# EAGLE design GarageDoorOpener (EAGLE 6.5.0)
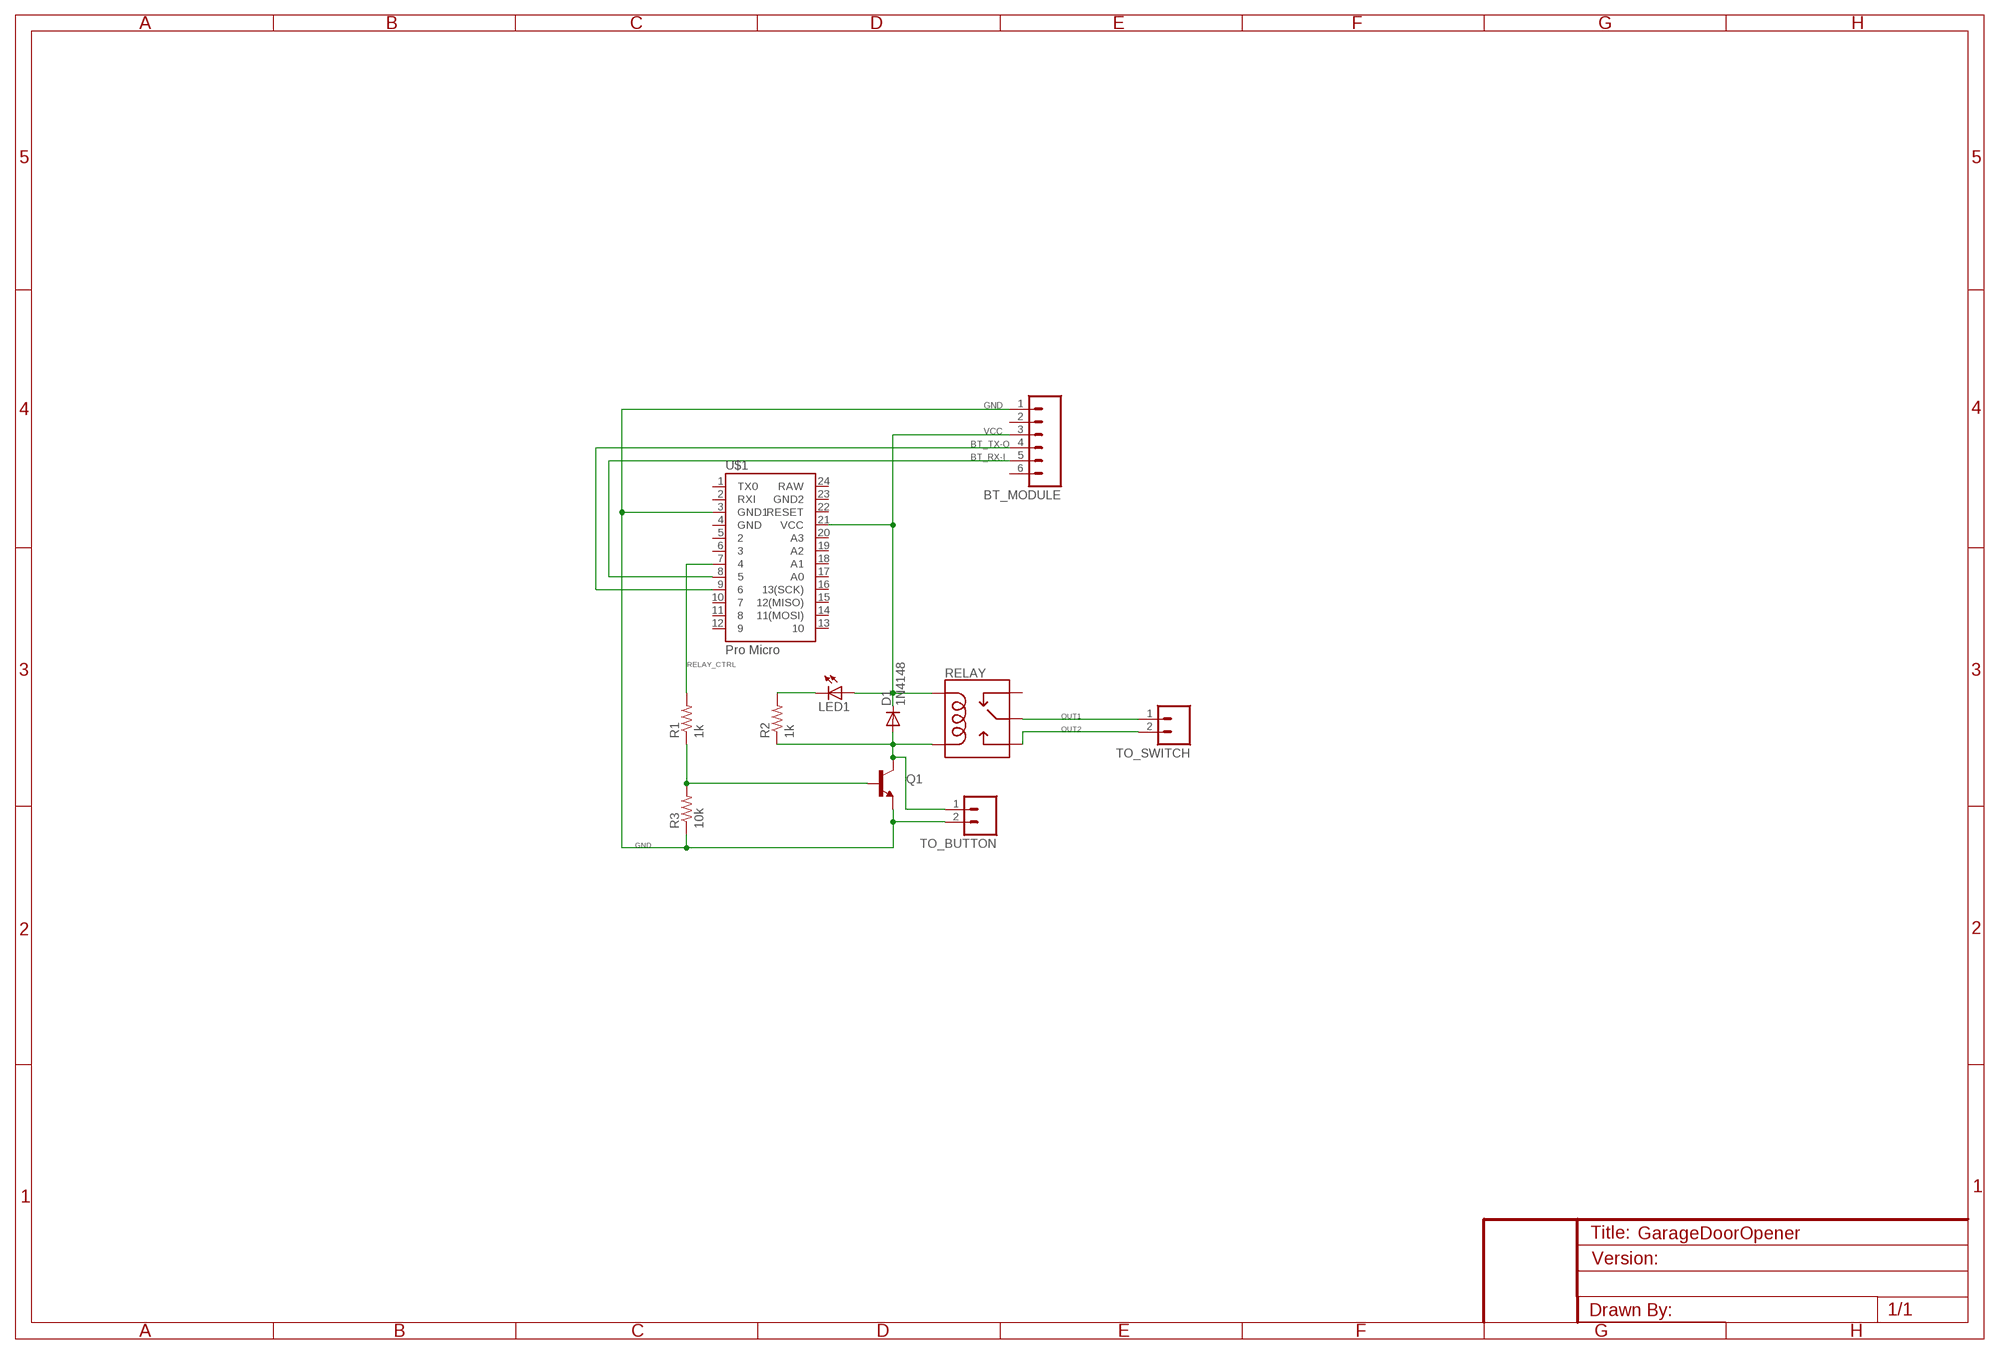
[diagram p0: schematic, sheet 1]

## Parts
BT_MODULE  M06LOCK  [1X06_LOCK]
D1  1N4148  DIODE1N4148  [DIODE-1N4148]
LED1  LED3MM  [LED3MM]
Q1  TRANSISTOR_NPNTO-92-AMMO  [TO-92-AMMO]
R1  1k  RESISTORAXIAL-0.3  [AXIAL-0.3]
R2  1k  RESISTORAXIAL-0.3  [AXIAL-0.3]
R3  10k  RESISTORAXIAL-0.3  [AXIAL-0.3]
RELAY  RELAYPTH4  [RELAY-JZC]
TO_BUTTON  M02LOCK  [1X02_LOCK]
TO_SWITCH  M02-JST-2-PTH-NO_SILK  [JST-2-PTH-NS]
U$1  Pro Micro  ARDUINO_PRO_MICRO  [ARDUINO_PRO_MICRO]

## Nets
BT_RX-I: BT_MODULE.5 U$1.8
BT_TX-O: BT_MODULE.4 U$1.9
GND: BT_MODULE.1 Q1.1(E) R3.P$1 TO_BUTTON.2 U$1.3(GND1)
N$1: D1.A Q1.3(C) R2.P$1 RELAY.1(COIL2) TO_BUTTON.1
N$2: Q1.2(B) R1.P$1 R3.P$2
N$11: LED1.K(C) R2.P$2
OUT1: RELAY.4(MAIN) TO_SWITCH.1
OUT2: RELAY.3(NO) TO_SWITCH.2
RELAY_CTRL: R1.P$2 U$1.7
VCC: BT_MODULE.3 D1.C LED1.A RELAY.5(COIL1) U$1.21(VCC)
Unconnected: BT_MODULE.2 BT_MODULE.6 RELAY.2(NC) U$1.1(TX0) U$1.2(RXI) U$1.4(GND) U$1.5 U$1.6 U$1.10 U$1.11 U$1.12 U$1.13 U$1.14(11(MOSI)) U$1.15(12(MISO)) U$1.16(13(SCK)) U$1.17(A0) U$1.18(A1) U$1.19(A2) U$1.20(A3) U$1.22(RESET) U$1.23(GND2) U$1.24(RAW)

## Library data of the parts
BT_MODULE = SparkFun-Connectors:M06: Header 6 Standard 6-pin 0.1" header. Use with straight break away headers (SKU : PRT-00116), right angle break away headers (PRT-00553), swiss pins (PRT-00743), machine pins (PRT-00117), and female headers (PRT-00115). Molex polarized connector foot print use with SKU : PRT-08094 with associated crimp pins and housings. NOTES ON THE VARIANTS LOCK and LOCK_LONGPADS... This footprint was designed to help hold the alignment of a through-hole component (i.e. 6-pin header) while soldering it into place. You may notice that each hole has been shifted either up or down by 0.005 of an inch from it's more standard position (which is a perfectly straight line). This slight alteration caused the pins (the squares in the middle) to touch the edges of the holes. Because they are alternating, it causes a "brace" to hold the component in place. 0.005 has proven to be the perfect amount of "off-center" position when using our standard breakaway headers. Although looks a little odd when you look at the bare footprint, once you have a header in there, the alteration is very hard to notice. Also,if you push a header all the way into place, it is covered up entirely on the bottom side. This idea of altering the position of holes to aid alignment will be further integrated into the Sparkfun Library for other footprints. It can help hold any component with 3 or more connection pins.
D1 = SparkFun-DiscreteSemi:DIODE: Diode These are standard reverse protection diodes and small signal diodes. SMA package can handle up to about 1A. SOD-323 can handle about 200mA. What the SOD-323 package when ordering, there are some mfgs out there that are 5-pin packages.
LED1 = SparkFun-LED:LED: LEDs Standard schematic elements and footprints for 5mm, 3mm, 1206, and 0603 sized LEDs. 5mm - Spark Fun Electronics SKU : COM-00529 (and others)
Q1 = SparkFun-DiscreteSemi:TRANSISTOR_NPN: Generic NPN BJT MMBT2222A - TRANS-08049 (SOT-23, 1A 40V) MPSA42 - TRANS-09116 (SOT-23, 500mA 300V) MMBT5088LT1G - TRANS-11160 (SOT-23, 50 mA 30V)
R1-R3 = SparkFun-Resistors:RESISTOR: Resistor Basic schematic elements and footprints for 0603, 1206, and PTH resistors.
RELAY = SparkFun-Electromechanical:RELAY: SPDT relay (COM-00101)
TO_BUTTON TO_SWITCH = SparkFun-Connectors:M02: Standard 2-pin 0.1" header. Use with - straight break away headers ( PRT-00116) - right angle break away headers (PRT-00553) - swiss pins (PRT-00743) - machine pins (PRT-00117) - female headers (PRT-00115) Molex polarized connector foot print use with: PRT-08233 with associated crimp pins and housings. 2.54_SCREWTERM for use with PRT-10571. 3.5mm Screw Terminal footprints for PRT-08084 5mm Screw Terminal footprints for use with PRT-08433
U$1 = SparkFun-Boards:ARDUINO_PRO_MICRO

## Board
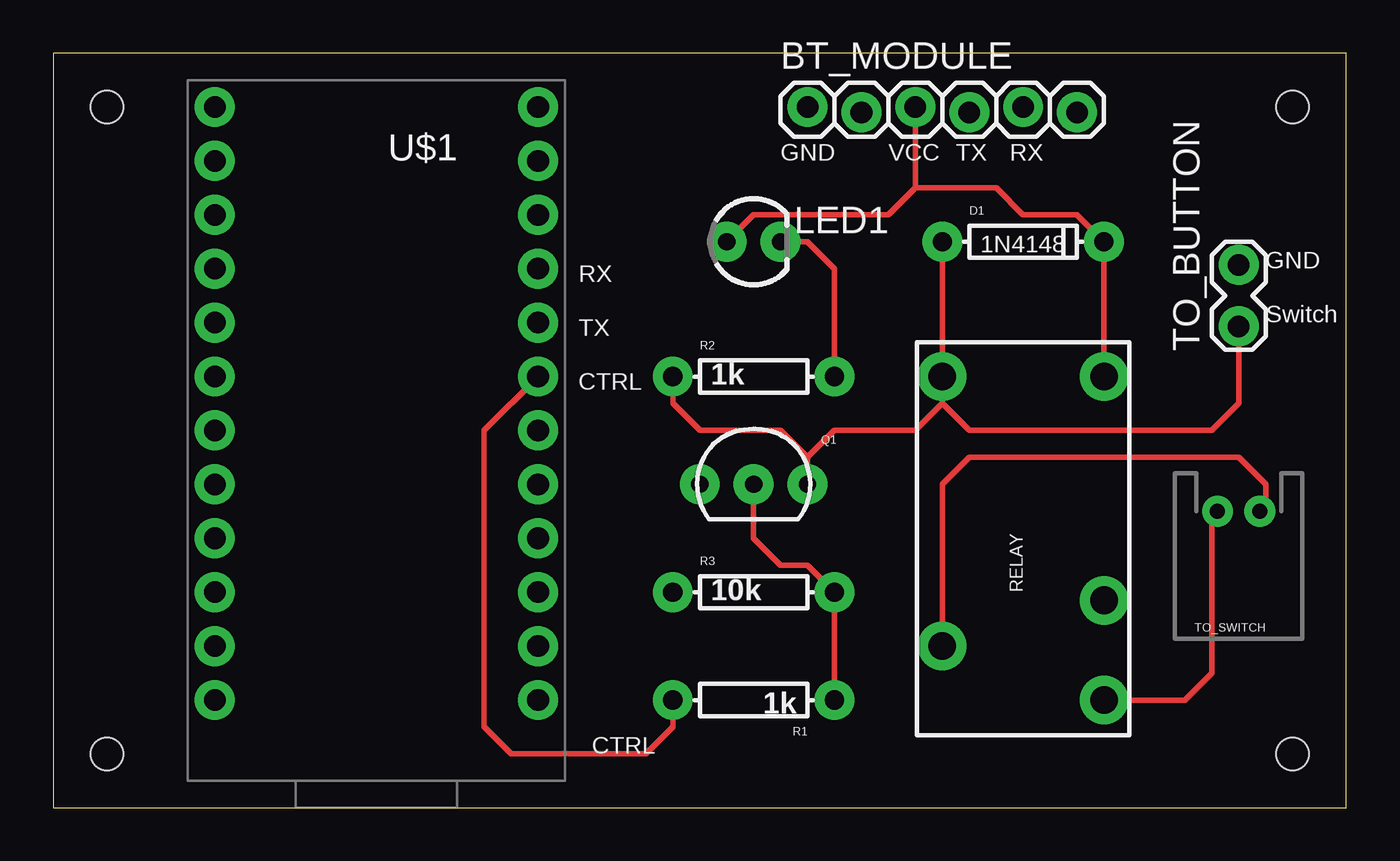
[diagram p1: board, top side]
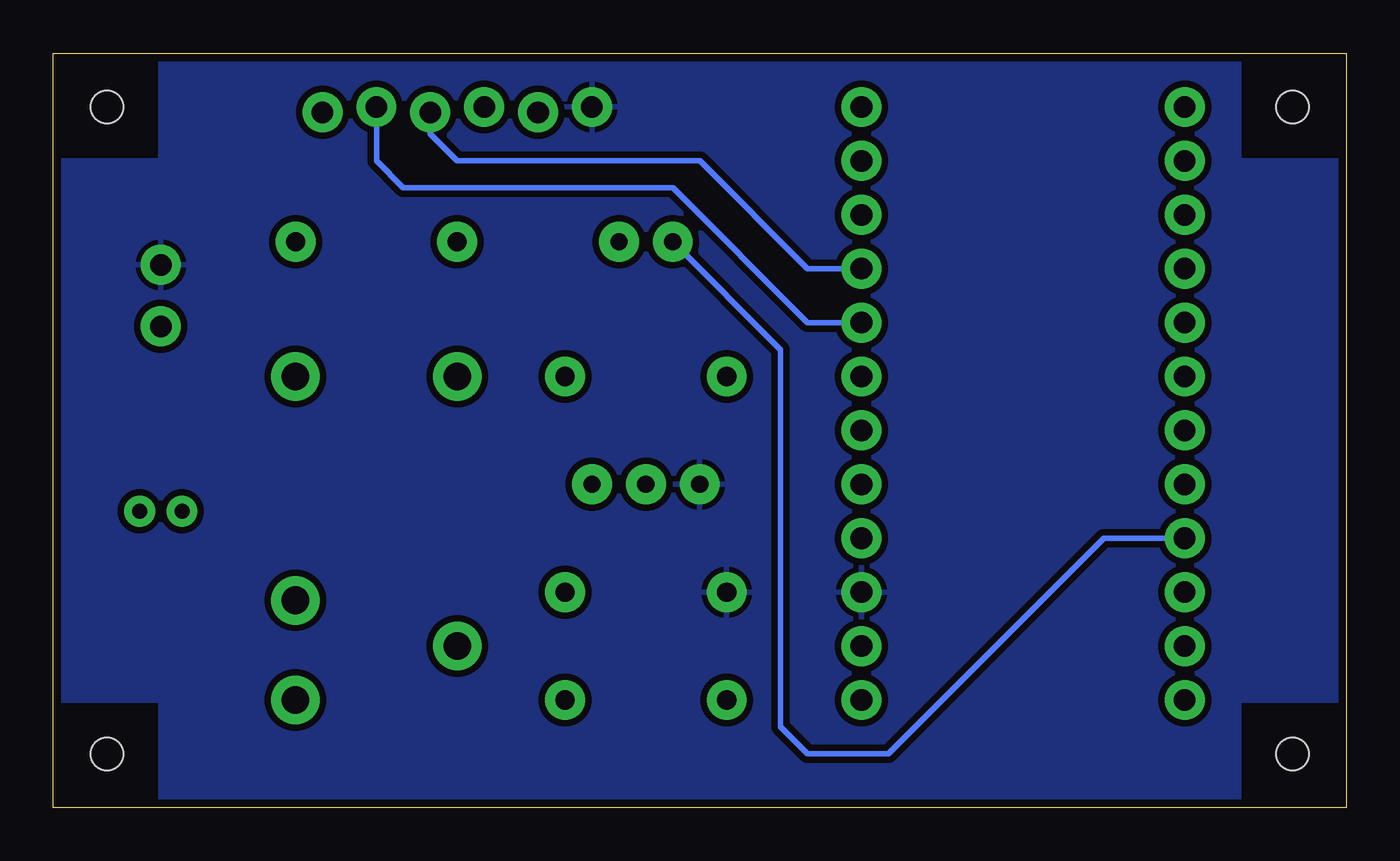
[diagram p2: board, bottom side, seen from below]

Size 60.96 x 35.56 mm. Coordinates in mm from the lower left corner, seen from the top.
Outline: 0,0 60.96,0 60.96,35.56 0,35.56 0,0
Copper layers (1*16): Top 0.0356mm / dielectric 1.5011mm / Bottom 0.0356mm
Design rules "LaenPCBOrder": minimum track width 6mil, minimum drill 13mil, track to track 6mil, track to pad 6mil, pad to pad 6mil, via to via 6mil, smd to smd 6mil, copper to edge 15mil, drill to drill 6mil, minimum pad ring 7mil, minimum via ring 7mil, stop-mask expansion 3mil, vias tented up to drill 0mil, thermal gap 10mil
Holes 1.52 mm at 2.54,33.02 58.42,33.02 2.54,2.54 58.42,2.54

### Footprints (pad centres in the part's own frame; a part is rotated, then mirrored left to right if it is on the bottom)
1X06_LOCK = drill 1.016 pad 1.88: 1 0,0; 2 2.54,-0.254; 3 5.08,0; 4 7.62,-0.254; 5 10.16,0; 6 12.7,-0.254
DIODE-1N4148 = drill 0.9 pad 1.88: A -3.81,0; C 3.81,0
LED3MM = drill 0.813 pad 1.88: A -1.27,0; K 1.27,0
TO-92-AMMO = drill 0.813 pad 1.88: 1 -2.54,0; 2 0,0; 3 2.54,0
AXIAL-0.3 = drill 0.9 pad 1.88: P$1 -3.81,0; P$2 3.81,0
RELAY-JZC = drill 1.3 pad 2.286: 1 3.81,-8.89; 2 -3.81,1.651; 3 -3.81,6.35; 4 3.81,3.81; 5 -3.81,-8.89
1X02_LOCK = drill 1.016 pad 1.88: 1 -0.178,0; 2 2.718,0
JST-2-PTH-NS = drill 0.7 pad 1.448: 1 -1,0; 2 1,0
ARDUINO_PRO_MICRO = drill 1.016 pad 1.88: 1 -7.62,12.7; 2 -7.62,10.16; 3 -7.62,7.62; 4 -7.62,5.08; 5 -7.62,2.54; 6 -7.62,0; 7 -7.62,-2.54; 8 -7.62,-5.08; 9 -7.62,-7.62; 10 -7.62,-10.16; 11 -7.62,-12.7; 12 -7.62,-15.24; 13 7.62,-15.24; 14 7.62,-12.7; 15 7.62,-10.16; 16 7.62,-7.62; 17 7.62,-5.08; 18 7.62,-2.54; 19 7.62,0; 20 7.62,2.54; 21 7.62,5.08; 22 7.62,7.62; 23 7.62,10.16; 24 7.62,12.7

### Placement (x,y rotation side)
BT_MODULE  35.56,33.02 0 top
D1  45.72,26.67 0 top
LED1  33.02,26.67 0 top
Q1  33.02,15.24 0 top
R1  33.02,5.08 180 top
R2  33.02,20.32 0 top
R3  33.02,10.16 0 top
RELAY  45.72,11.43 180 top
TO_BUTTON  55.88,22.86 90 top
TO_SWITCH  55.88,13.97 180 top
U$1  15.24,17.78 180 top

### Tracks (layer width: path | path; a pad name or v marks a point on that pad's centre or on a via)
BT_RX-I
  Bottom 0.254: U$1.8 25.4,22.86 31.75,29.21 44.45,29.21 45.72,30.48 BT_MODULE.5
BT_TX-O
  Bottom 0.254: BT_MODULE.4 43.18,31.75 41.91,30.48 30.48,30.48 25.4,25.4 U$1.9
GND
  pour Bottom (isolate 0.305): 5.08,30.48 0,30.48 0,5.08 5.08,5.08 5.08,0 55.88,0 55.88,5.08 60.96,5.08 60.96,30.48 55.88,30.48 55.88,35.56 5.08,35.56
N$1
  Top 0.254: D1.A RELAY.1 41.91,19.05 | R2.P$1 29.21,19.05 30.48,17.78 34.29,17.78 35.56,16.51 | Q1.3 35.56,16.51 | 35.56,16.51 36.83,17.78 40.64,17.78 41.91,19.05 | 41.91,19.05 43.18,17.78 54.61,17.78 55.88,19.05 TO_BUTTON.1
N$2
  Top 0.254: Q1.2 33.02,12.7 34.29,11.43 35.56,11.43 R3.P$2 R1.P$1
N$11
  Top 0.254: LED1.K 35.56,26.67 36.83,25.4 R2.P$2
OUT1
  Top 0.254: RELAY.4 41.91,15.24 43.18,16.51 55.88,16.51 57.15,15.24 57.15,14.24 TO_SWITCH.1
OUT2
  Top 0.254: RELAY.3 53.34,5.08 54.61,6.35 54.61,13.7 TO_SWITCH.2
RELAY_CTRL
  Top 0.254: R1.P$2 29.21,3.81 27.94,2.54 21.59,2.54 20.32,3.81 20.32,17.78 U$1.7
VCC
  Top 0.254: RELAY.5 D1.C 48.26,27.94 45.72,27.94 44.45,29.21 40.64,29.21 | 40.64,29.21 39.37,27.94 33.02,27.94 LED1.A | BT_MODULE.3 40.64,29.21
  Bottom 0.254: U$1.21 11.43,12.7 21.59,2.54 25.4,2.54 26.67,3.81 26.67,21.59 LED1.A

### Text on the board
tPlace: GND | VCC | TX | RX | RX | GND | Switch | TX | CTRL | CTRL